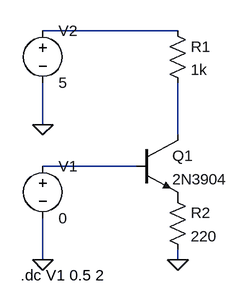
[diagram p0: schematic bias_point.asc]
bias_point.asc, the LTspice schematic file:
Version 4
SHEET 1 880 680
WIRE 176 16 -32 16
WIRE -32 160 -32 96
WIRE 176 176 176 96
WIRE 112 224 -32 224
WIRE -32 368 -32 304
WIRE 176 368 176 352
FLAG -32 160 0
FLAG -32 368 0
FLAG 176 368 0
SYMBOL npn 112 176 R0
SYMATTR InstName Q1
SYMATTR Value 2N3904
SYMBOL res 160 0 R0
SYMATTR InstName R1
SYMATTR Value 1k
SYMBOL voltage -32 208 R0
WINDOW 123 0 0 Left 0
WINDOW 39 0 0 Left 0
SYMATTR InstName V1
SYMATTR Value 0
SYMBOL voltage -32 0 R0
WINDOW 123 0 0 Left 0
WINDOW 39 0 0 Left 0
SYMATTR InstName V2
SYMATTR Value 5
SYMBOL res 160 256 R0
SYMATTR InstName R2
SYMATTR Value 220
TEXT -66 392 Left 2 !.dc V1 0.5 2

The netlist it stands for:
* bias_point.asc
Q1 N002 N003 P001 0 2N3904
R1 N001 N002 1k
V1 N003 0 0
V2 N001 0 5
R2 P001 0 220
.model NPN NPN
.model PNP PNP
.lib standard.bjt
.dc V1 0.5 2
.backanno
.end